# EAGLE schematic Raspberry_output_for_PWM_based_Fan_driver (EAGLE 7.5.0)
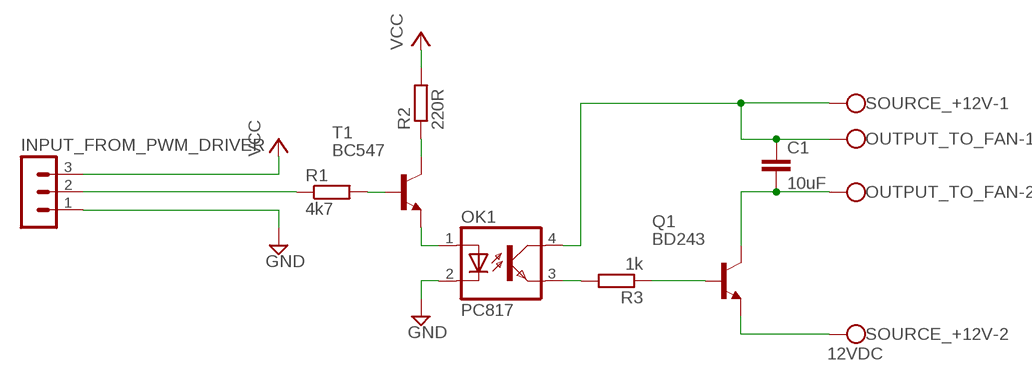
[diagram p0: schematic, sheet 1]

## Parts
C1  10uF  C2.5/5  [C2.5-5]
INPUT_FROM_PWM_DRIVER  MA03-1  [MA03-1]
OK1  PC817  [DIL04]
OUTPUT_TO_FAN  W237-102  [W237-102]
Q1  BD243  [TO220]
R1  4k7  R-EU_0207/10  [0207/10]
R2  220R  R-EU_0207/10  [0207/10]
R3  1k  R-EU_0207/10  [0207/10]
SOURCE_+12V  12VDC  W237-102  [W237-102]
T1  BC547  [TO92]

## Nets
GND: INPUT_FROM_PWM_DRIVER.1 OK1.2(C)
INPUT: INPUT_FROM_PWM_DRIVER.2 R1.1
INPUT_REGULATED_CURR_2_BASE: R1.2 T1.2(B)
N$2: R2.1 T1.3(C)
OPTO_IN: OK1.1(A) T1.1(E)
OPTO_OUT_2_TR: OK1.3(EMIT) R3.2
OUTPUT_N: C1.2 OUTPUT_TO_FAN.2 Q1.2(C)
SOURCE_N_0V: Q1.3(E) SOURCE_+12V.2
SOURCE_P_12V: C1.1 OK1.4(COL) OUTPUT_TO_FAN.1 SOURCE_+12V.1
TR_OUTPUT_BASE: Q1.1(B) R3.1
VCC: INPUT_FROM_PWM_DRIVER.3 R2.2

## Library data of the parts
C1 = capacitor-wima:C: CAPACITOR naming: grid - package width
INPUT_FROM_PWM_DRIVER = con-lstb:MA03-1: PIN HEADER
OK1 = optocoupler:PC817: SHARP OPTO COUPLER
OUTPUT_TO_FAN SOURCE_+12V = con-wago-500:W237-102: WAGO SCREW CLAMP
Q1 = transistor-npn:BD243*: NPN Transistor
R1-R3 = rcl:R-EU_: RESISTOR, European symbol
T1 = transistor-neu-to92:BC547: NPN TRANSISTOR